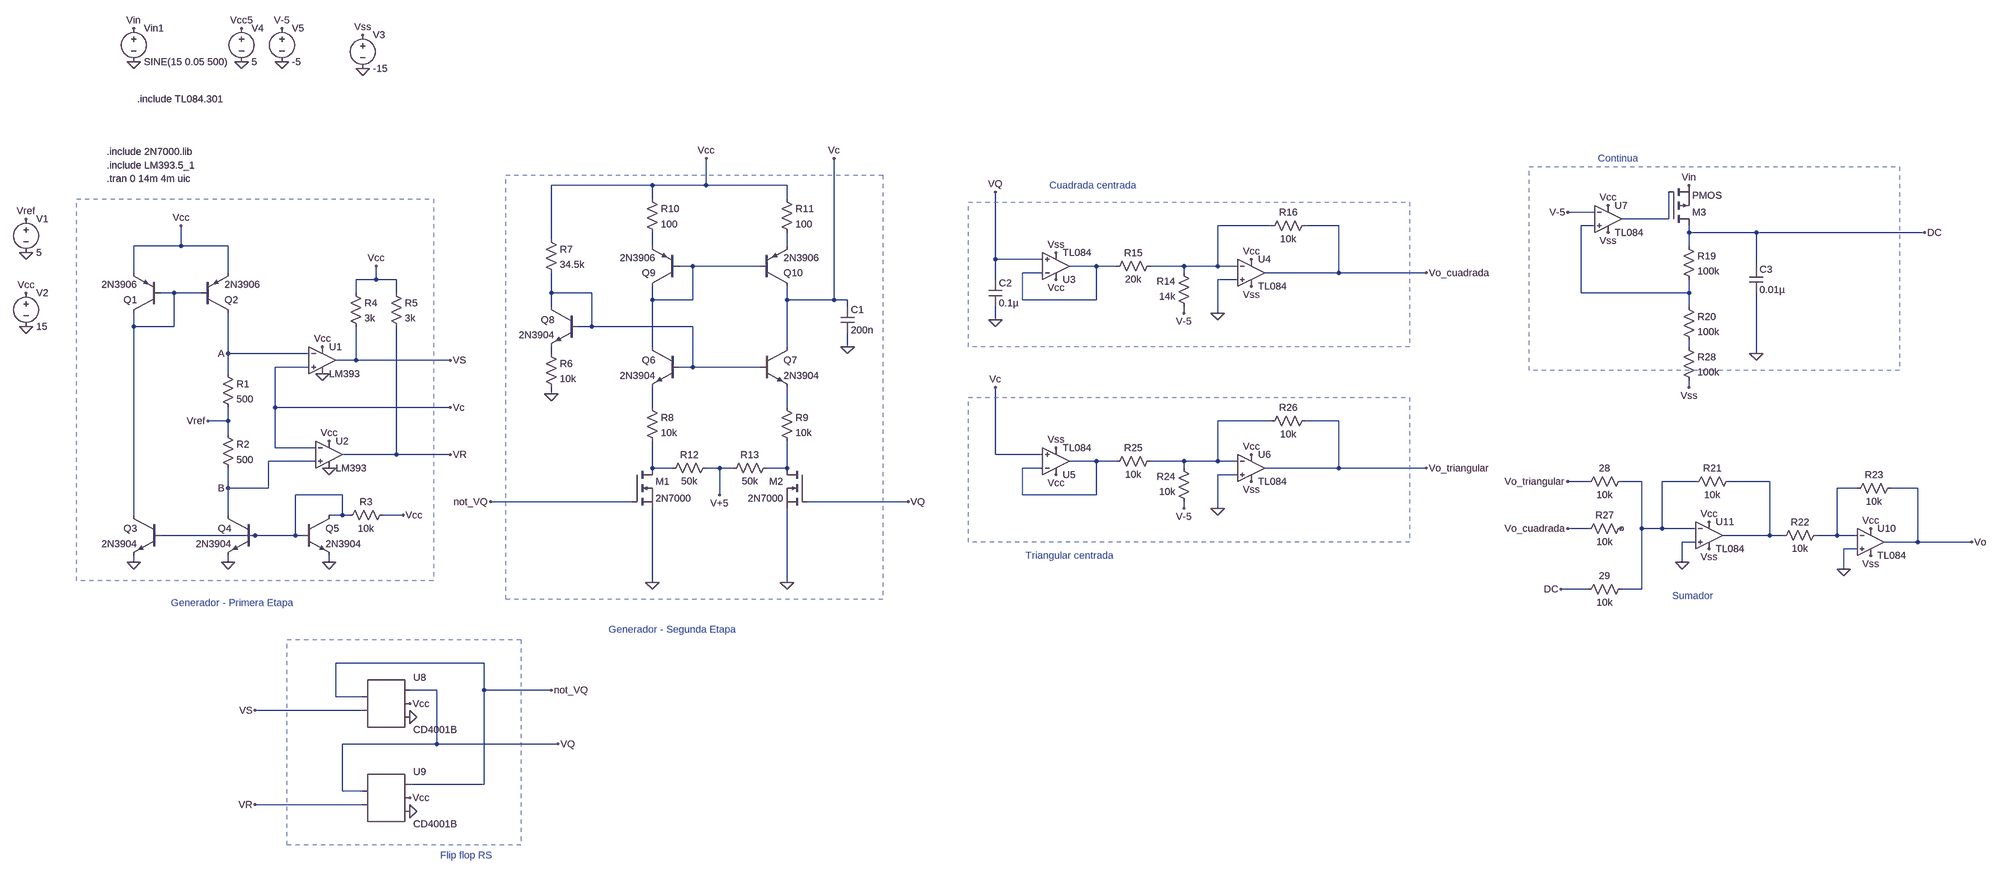
[diagram p0: schematic CIRCUITO_FINAL_PROLIJO_DC(correcta).asc]
CIRCUITO_FINAL_PROLIJO_DC(correcta).asc, the LTspice schematic file:
Version 4
SHEET 1 4360 2064
WIRE 720 -176 480 -176
WIRE 848 -176 848 -240
WIRE 848 -176 720 -176
WIRE 1040 -176 848 -176
WIRE 720 -144 720 -176
WIRE 1040 -144 1040 -176
WIRE 2976 -112 2912 -112
WIRE 3152 -96 3152 -160
WIRE 3152 -96 3040 -96
WIRE 2208 -80 2080 -80
WIRE 2368 -80 2288 -80
WIRE 2976 -80 2944 -80
WIRE 3200 -64 3200 -80
WIRE 3360 -64 3200 -64
WIRE 3760 -64 3360 -64
WIRE 480 -48 480 -176
WIRE -400 -32 -400 -80
WIRE -400 -32 -512 -32
WIRE -288 -32 -400 -32
WIRE 720 -32 720 -64
WIRE 1040 -32 1040 -64
WIRE 3200 -32 3200 -64
WIRE 1552 0 1552 -160
WIRE 1664 0 1552 0
WIRE 816 16 784 16
WIRE 976 16 816 16
WIRE 1792 16 1728 16
WIRE 1840 16 1792 16
WIRE 2000 16 1920 16
WIRE 2080 16 2080 -80
WIRE 2080 16 2000 16
WIRE 2128 16 2080 16
WIRE 3360 16 3360 -64
WIRE -512 32 -512 -32
WIRE -288 32 -288 -32
WIRE 1664 32 1616 32
WIRE 2000 32 2000 16
WIRE 2368 32 2368 -80
WIRE 2368 32 2192 32
WIRE 2576 32 2368 32
WIRE 64 48 64 16
WIRE 64 48 16 48
WIRE 112 48 64 48
WIRE 1552 48 1552 0
WIRE 2128 48 2080 48
WIRE -416 80 -448 80
WIRE -352 80 -416 80
WIRE 16 80 16 48
WIRE 112 80 112 48
WIRE 480 80 480 32
WIRE 576 80 480 80
WIRE 2944 80 2944 -80
WIRE 3200 80 3200 48
WIRE 3200 80 2944 80
WIRE 720 96 720 64
WIRE 816 96 816 16
WIRE 816 96 720 96
WIRE 1040 96 1040 64
WIRE 1152 96 1152 -240
WIRE 1152 96 1040 96
WIRE 1184 96 1152 96
WIRE 1616 96 1616 32
WIRE 1792 96 1792 16
WIRE 1792 96 1616 96
WIRE 480 112 480 80
WIRE 1184 112 1184 96
WIRE 3200 112 3200 80
WIRE 2000 128 2000 112
WIRE 2080 128 2080 48
WIRE 1552 144 1552 112
WIRE -512 160 -512 128
WIRE -416 160 -416 80
WIRE -416 160 -512 160
WIRE 576 160 576 80
WIRE 576 160 544 160
WIRE 816 160 576 160
WIRE 720 208 720 96
WIRE 1040 208 1040 96
WIRE 1184 208 1184 176
WIRE 3200 208 3200 192
WIRE -288 224 -288 128
WIRE -96 224 -288 224
WIRE 480 224 480 208
WIRE 3360 224 3360 80
WIRE 16 240 16 160
WIRE 16 240 -32 240
WIRE 240 240 16 240
WIRE -96 256 -176 256
WIRE 816 256 816 160
WIRE 816 256 784 256
WIRE 976 256 816 256
WIRE -288 272 -288 224
WIRE 3200 304 3200 288
WIRE 480 320 480 304
WIRE -176 352 -176 256
WIRE 240 352 -176 352
WIRE 720 352 720 304
WIRE 1040 352 1040 304
WIRE -288 384 -288 352
WIRE -288 384 -336 384
WIRE 2208 384 2080 384
WIRE 2368 384 2288 384
WIRE -288 416 -288 384
WIRE -176 448 -176 352
WIRE -80 448 -176 448
WIRE 112 464 112 160
WIRE 112 464 -16 464
WIRE 240 464 112 464
WIRE 1552 464 1552 304
WIRE 1664 464 1552 464
WIRE -80 480 -192 480
WIRE 1792 480 1728 480
WIRE 1840 480 1792 480
WIRE 2000 480 1920 480
WIRE 2080 480 2080 384
WIRE 2080 480 2000 480
WIRE 2128 480 2080 480
WIRE 720 496 720 432
WIRE 768 496 720 496
WIRE 880 496 848 496
WIRE 912 496 880 496
WIRE 1040 496 1040 432
WIRE 1040 496 992 496
WIRE 1664 496 1616 496
WIRE 2000 496 2000 480
WIRE 2368 496 2368 384
WIRE 2368 496 2192 496
WIRE 2576 496 2368 496
WIRE 2128 512 2080 512
WIRE 2960 528 2912 528
WIRE 3088 528 3040 528
WIRE 3216 528 3136 528
WIRE 3392 528 3296 528
WIRE -288 544 -288 496
WIRE -192 544 -192 480
WIRE -192 544 -288 544
WIRE 3600 544 3552 544
WIRE 3744 544 3680 544
WIRE -16 560 -128 560
WIRE 880 560 880 496
WIRE 1616 560 1616 496
WIRE 1792 560 1792 480
WIRE 1792 560 1616 560
WIRE 672 576 336 576
WIRE 1328 576 1088 576
WIRE 2000 592 2000 576
WIRE 2080 592 2080 512
WIRE -512 608 -512 160
WIRE -288 608 -288 544
WIRE -16 608 -16 560
WIRE -16 608 -48 608
WIRE 0 608 -16 608
WIRE 128 608 80 608
WIRE 2960 640 2912 640
WIRE 3088 640 3088 528
WIRE 3136 640 3136 528
WIRE 3136 640 3088 640
WIRE 3216 640 3136 640
WIRE -224 656 -448 656
WIRE -128 656 -128 560
WIRE -128 656 -224 656
WIRE -112 656 -128 656
WIRE 3392 656 3392 528
WIRE 3392 656 3280 656
WIRE 3424 656 3392 656
WIRE 3552 656 3552 544
WIRE 3552 656 3504 656
WIRE 3600 656 3552 656
WIRE 3216 672 3184 672
WIRE 3744 672 3744 544
WIRE 3744 672 3664 672
WIRE 3872 672 3744 672
WIRE 3600 688 3568 688
WIRE -512 720 -512 704
WIRE -288 720 -288 704
WIRE -48 720 -48 704
WIRE 3184 720 3184 672
WIRE 3568 736 3568 688
WIRE 720 768 720 592
WIRE 1040 768 1040 592
WIRE 2960 784 2896 784
WIRE 3088 784 3088 640
WIRE 3088 784 3040 784
WIRE 320 960 -32 960
WIRE 208 1024 144 1024
WIRE 320 1024 320 960
WIRE 480 1024 320 1024
WIRE -32 1040 -32 960
WIRE 32 1040 -32 1040
WIRE 32 1072 -224 1072
WIRE 208 1152 208 1024
WIRE 208 1152 -16 1152
WIRE 496 1152 208 1152
WIRE 320 1248 320 1024
WIRE 320 1248 144 1248
WIRE -16 1264 -16 1152
WIRE 32 1264 -16 1264
WIRE 32 1296 -224 1296
FLAG -48 720 0
FLAG -288 720 0
FLAG -512 720 0
FLAG 480 320 0
FLAG 1184 208 0
FLAG 848 -240 Vcc
FLAG 880 560 V+5
FLAG 1040 768 0
FLAG 720 768 0
FLAG -400 -80 Vcc
FLAG 128 608 Vcc
FLAG 240 240 VS
FLAG 240 464 VR
FLAG -336 384 Vref
FLAG 240 352 Vc
FLAG 1328 576 VQ
FLAG 336 576 not_VQ
FLAG 1152 -240 Vc
FLAG -768 -16 0
FLAG -768 80 Vcc
FLAG 32 -800 Vss
FLAG 32 -720 0
FLAG -768 160 0
FLAG -256 -816 Vcc5
FLAG -256 -736 0
FLAG -160 -736 0
FLAG -160 -816 V-5
FLAG -512 -816 Vin
FLAG -512 -736 0
FLAG -768 -96 Vref
FLAG -64 208 Vcc
FLAG -64 272 0
FLAG -48 432 Vcc
FLAG -48 496 0
FLAG 64 16 Vcc
FLAG -288 224 A
FLAG -288 544 B
FLAG 1696 48 Vcc
FLAG 1696 -16 Vss
FLAG 1552 144 0
FLAG 2000 128 V-5
FLAG 2080 128 0
FLAG 1552 -160 VQ
FLAG 2576 32 Vo_cuadrada
FLAG 2912 -112 V-5
FLAG 3360 224 0
FLAG 3760 -64 DC
FLAG 3872 672 Vo
FLAG 3184 720 0
FLAG 3568 736 0
FLAG 2160 0 Vcc
FLAG 2160 64 Vss
FLAG 1696 512 Vcc
FLAG 1696 448 Vss
FLAG 2000 592 V-5
FLAG 2080 592 0
FLAG 1552 304 Vc
FLAG 2576 496 Vo_triangular
FLAG 2160 464 Vcc
FLAG 2160 528 Vss
FLAG 3008 -128 Vcc
FLAG 3008 -64 Vss
FLAG 3632 640 Vcc
FLAG 3632 704 Vss
FLAG 3248 624 Vcc
FLAG 3248 688 Vss
FLAG -224 1072 VS
FLAG -224 1296 VR
FLAG 144 1280 Vcc
FLAG 144 1312 0
FLAG 144 1088 0
FLAG 144 1056 Vcc
FLAG 496 1152 VQ
FLAG 480 1024 not_VQ
FLAG 2896 784 DC
FLAG 3200 304 Vss
FLAG 2912 528 Vo_triangular
FLAG 3200 -176 Vin
FLAG 2912 640 Vo_cuadrada
SYMBOL pnp -352 128 M180
SYMATTR InstName Q2
SYMATTR Value 2N3906
SYMBOL pnp -448 128 R180
SYMATTR InstName Q1
SYMATTR Value 2N3906
SYMBOL npn -448 608 M0
SYMATTR InstName Q3
SYMATTR Value 2N3904
SYMBOL res -304 256 R0
SYMATTR InstName R1
SYMATTR Value 500
SYMBOL res -304 400 R0
SYMATTR InstName R2
SYMATTR Value 500
SYMBOL npn -224 608 M0
SYMATTR InstName Q4
SYMATTR Value 2N3904
SYMBOL npn -112 608 R0
SYMATTR InstName Q5
SYMATTR Value 2N3904
SYMBOL res 96 592 R90
WINDOW 0 0 56 VBottom 2
WINDOW 3 32 56 VTop 2
SYMATTR InstName R3
SYMATTR Value 10k
SYMBOL res 864 480 R90
WINDOW 0 0 56 VBottom 2
WINDOW 3 32 56 VTop 2
SYMATTR InstName R12
SYMATTR Value 50k
SYMBOL res 1008 480 R90
WINDOW 0 0 56 VBottom 2
WINDOW 3 32 56 VTop 2
SYMATTR InstName R13
SYMATTR Value 50k
SYMBOL npn 976 208 R0
SYMATTR InstName Q7
SYMATTR Value 2N3904
SYMBOL npn 784 208 M0
SYMATTR InstName Q6
SYMATTR Value 2N3904
SYMBOL npn 544 112 M0
SYMATTR InstName Q8
SYMATTR Value 2N3904
SYMBOL res 464 208 R0
SYMATTR InstName R6
SYMATTR Value 10k
SYMBOL res 464 -64 R0
SYMATTR InstName R7
SYMATTR Value 34.5k
SYMBOL cap 1168 112 R0
SYMATTR InstName C1
SYMATTR Value 200n
SYMBOL pnp 784 64 R180
SYMATTR InstName Q9
SYMATTR Value 2N3906
SYMBOL pnp 976 64 M180
SYMATTR InstName Q10
SYMATTR Value 2N3906
SYMBOL voltage -768 -112 R0
WINDOW 123 0 0 Left 2
WINDOW 39 0 0 Left 2
SYMATTR InstName V1
SYMATTR Value 5
SYMBOL voltage -768 64 R0
WINDOW 123 0 0 Left 2
WINDOW 39 0 0 Left 2
SYMATTR InstName V2
SYMATTR Value 15
SYMBOL voltage 32 -816 R0
WINDOW 123 0 0 Left 2
WINDOW 39 0 0 Left 2
SYMATTR InstName V3
SYMATTR Value -15
SYMBOL voltage -256 -832 R0
WINDOW 123 0 0 Left 2
WINDOW 39 0 0 Left 2
SYMATTR InstName V4
SYMATTR Value 5
SYMBOL voltage -160 -832 R0
WINDOW 123 0 0 Left 2
WINDOW 39 0 0 Left 2
SYMATTR InstName V5
SYMATTR Value -5
SYMBOL voltage -512 -832 R0
WINDOW 123 0 0 Left 2
WINDOW 39 0 0 Left 2
SYMATTR InstName Vin1
SYMATTR Value SINE(15 0.05 500)
SYMBOL opamp2 -48 400 R0
SYMATTR InstName U2
SYMATTR Value LM393
SYMBOL opamp2 -64 176 R0
SYMATTR InstName U1
SYMATTR Value LM393
SYMBOL res 704 336 R0
SYMATTR InstName R8
SYMATTR Value 10k
SYMBOL res 1024 336 R0
SYMATTR InstName R9
SYMATTR Value 10k
SYMBOL res 1024 -160 R0
SYMATTR InstName R11
SYMATTR Value 100
SYMBOL res 704 -160 R0
SYMATTR InstName R10
SYMATTR Value 100
SYMBOL res 0 64 R0
SYMATTR InstName R4
SYMATTR Value 3k
SYMBOL res 96 64 R0
SYMATTR InstName R5
SYMATTR Value 3k
SYMBOL cap 1536 48 R0
SYMATTR InstName C2
SYMATTR Value 0.1µ
SYMBOL res 2016 128 R180
WINDOW 0 36 76 Left 2
WINDOW 3 36 40 Left 2
SYMATTR InstName R14
SYMATTR Value 14k
SYMBOL res 1936 0 R90
WINDOW 0 0 56 VBottom 2
WINDOW 3 32 56 VTop 2
SYMATTR InstName R15
SYMATTR Value 20k
SYMBOL res 2304 -96 R90
WINDOW 0 0 56 VBottom 2
WINDOW 3 32 56 VTop 2
SYMATTR InstName R16
SYMATTR Value 10k
SYMBOL cap 3344 16 R0
SYMATTR InstName C3
SYMATTR Value 0.01µ
SYMBOL res 3184 -48 R0
SYMATTR InstName R19
SYMATTR Value 100k
SYMBOL res 3184 96 R0
SYMATTR InstName R20
SYMATTR Value 100k
SYMBOL pmos 3152 -80 M180
SYMATTR InstName M3
SYMBOL res 3312 512 R90
WINDOW 0 0 56 VBottom 2
WINDOW 3 32 56 VTop 2
SYMATTR InstName R21
SYMATTR Value 10k
SYMBOL res 3520 640 R90
WINDOW 0 0 56 VBottom 2
WINDOW 3 32 56 VTop 2
SYMATTR InstName R22
SYMATTR Value 10k
SYMBOL res 3696 528 R90
WINDOW 0 0 56 VBottom 2
WINDOW 3 32 56 VTop 2
SYMATTR InstName R23
SYMATTR Value 10k
SYMBOL opamp2 1696 80 M180
SYMATTR InstName U3
SYMATTR Value TL084
SYMBOL opamp2 2160 -32 R0
SYMATTR InstName U4
SYMATTR Value TL084
SYMBOL res 2016 592 R180
WINDOW 0 36 76 Left 2
WINDOW 3 36 40 Left 2
SYMATTR InstName R24
SYMATTR Value 10k
SYMBOL res 1936 464 R90
WINDOW 0 0 56 VBottom 2
WINDOW 3 32 56 VTop 2
SYMATTR InstName R25
SYMATTR Value 10k
SYMBOL res 2304 368 R90
WINDOW 0 0 56 VBottom 2
WINDOW 3 32 56 VTop 2
SYMATTR InstName R26
SYMATTR Value 10k
SYMBOL opamp2 1696 544 M180
SYMATTR InstName U5
SYMATTR Value TL084
SYMBOL opamp2 2160 432 R0
SYMATTR InstName U6
SYMATTR Value TL084
SYMBOL opamp2 3008 -160 R0
SYMATTR InstName U7
SYMATTR Value TL084
SYMBOL opamp2 3632 608 R0
SYMATTR InstName U10
SYMATTR Value TL084
SYMBOL opamp2 3248 592 R0
SYMATTR InstName U11
SYMATTR Value TL084
SYMBOL AutoGenerated/CD4001B 80 1056 R0
SYMATTR InstName U8
SYMBOL AutoGenerated/CD4001B 80 1280 R0
SYMATTR InstName U9
SYMBOL nmos 672 496 R0
SYMATTR InstName M1
SYMATTR Value 2N7000
SYMATTR Prefix X
SYMBOL nmos 1088 496 M0
SYMATTR InstName M2
SYMATTR Value 2N7000
SYMATTR Prefix X
SYMBOL res 3184 192 R0
SYMATTR InstName R28
SYMATTR Value 100k
SYMBOL res 3056 512 R90
WINDOW 0 0 56 VBottom 2
WINDOW 3 32 56 VTop 2
SYMATTR InstName 28
SYMATTR Value 10k
SYMBOL res 3056 624 R90
WINDOW 0 0 56 VBottom 2
WINDOW 3 32 56 VTop 2
SYMATTR InstName R27
SYMATTR Value 10k
SYMBOL res 3056 768 R90
WINDOW 0 0 56 VBottom 2
WINDOW 3 32 56 VTop 2
SYMATTR InstName 29
SYMATTR Value 10k
TEXT -424 816 Left 2 ;Generador - Primera Etapa
TEXT 616 880 Left 2 ;Generador - Segunda Etapa
TEXT -576 -192 Left 2 !.tran 0 14m 4m uic
TEXT -504 -648 Left 2 !.include TL084.301
TEXT -576 -224 Left 2 !.include LM393.5_1
TEXT 1624 704 Left 2 ;Triangular centrada
TEXT 1680 -176 Left 2 ;Cuadrada centrada
TEXT 2984 -240 Left 2 ;Continua
TEXT 3160 800 Left 2 ;Sumador
TEXT 216 1416 Left 2 ;Flip flop RS
TEXT -576 -256 Left 2 !.include 2N7000.lib
RECTANGLE Normal 372 -200 1268 808 2
RECTANGLE Normal -648 -144 200 764 2
RECTANGLE Normal 1488 -136 2536 208 2
RECTANGLE Normal 2820 -220 3700 264 2
RECTANGLE Normal 1488 328 2536 672 2
RECTANGLE Normal -148 904 408 1392 2

The netlist it stands for:
* CIRCUITO_FINAL_PROLIJO_DC(correcta).asc
Q2 A N008 Vcc 0 2N3906
Q1 N008 N008 Vcc 0 2N3906
Q3 N008 N021 0 0 2N3904
R1 A Vref 500
R2 Vref B 500
Q4 B N021 0 0 2N3904
Q5 N021 N021 0 0 2N3904
R3 Vcc N021 10k
R12 V+5 N016 50k
R13 N017 V+5 50k
Q7 Vc N009 N013 0 2N3904
Q6 N006 N009 N012 0 2N3904
Q8 N009 N009 N011 0 2N3904
R6 N011 0 10k
R7 Vcc N009 34.5k
C1 Vc 0 200n
Q9 N006 N006 N004 0 2N3906
Q10 Vc N006 N005 0 2N3906
V1 Vref 0 5
V2 Vcc 0 15
V3 Vss 0 -15
V4 Vcc5 0 5
V5 V-5 0 -5
Vin1 Vin 0 SINE(15 0.05 500)
XU2 B Vc Vcc 0 VR LM393  ; pins In+ In- V+ V- OUT
XU1 Vc A Vcc 0 VS LM393  ; pins In+ In- V+ V- OUT
R8 N012 N016 10k
R9 N013 N017 10k
R11 Vcc N005 100
R10 Vcc N004 100
R4 Vcc VS 3k
R5 Vcc VR 3k
C2 VQ 0 0.1µ
R14 V-5 N002 14k
R15 N002 N007 20k
R16 Vo_cuadrada N002 10k
C3 DC 0 0.01µ
R19 DC N003 100k
R20 N003 N010 100k
M3 DC N001 Vin Vin PMOS
R21 N019 N018 10k
R22 N020 N019 10k
R23 Vo N020 10k
XU3 VQ N007 Vcc Vss N007 TL084  ; pins In+ In- V+ V- OUT
XU4 0 N002 Vcc Vss Vo_cuadrada TL084  ; pins In+ In- V+ V- OUT
R24 V-5 N014 10k
R25 N014 N015 10k
R26 Vo_triangular N014 10k
XU5 Vc N015 Vcc Vss N015 TL084  ; pins In+ In- V+ V- OUT
XU6 0 N014 Vcc Vss Vo_triangular TL084  ; pins In+ In- V+ V- OUT
XU7 N003 V-5 Vcc Vss N001 TL084  ; pins In+ In- V+ V- OUT
XU10 0 N020 Vcc Vss Vo TL084  ; pins In+ In- V+ V- OUT
XU11 0 N018 Vcc Vss N019 TL084  ; pins In+ In- V+ V- OUT
* U8: CD4001B (symbol AutoGenerated/CD4001B not available, pins judged from their places): pin1=not_VQ pin2=VS pin3=VQ pin4=Vcc pin5=0
* U9: CD4001B (symbol AutoGenerated/CD4001B not available, pins judged from their places): pin1=VQ pin2=VR pin3=not_VQ pin4=Vcc pin5=0
XM1 N016 not_VQ 0 2N7000  ; pins D G S
XM2 N017 VQ 0 2N7000  ; pins D G S
R28 N010 Vss 100k
R§28 N018 Vo_triangular 10k
R27 NC_01 Vo_cuadrada 10k
R§29 N018 DC 10k
.model NPN NPN
.model PNP PNP
.lib standard.bjt
.model NMOS NMOS
.model PMOS PMOS
.lib standard.mos
* Generador - Primera Etapa
* Generador - Segunda Etapa
.tran 0 14m 4m uic
.include TL084.301
.include LM393.5_1
* Triangular centrada
* Cuadrada centrada
* Continua
* Sumador
* Flip flop RS
.include 2N7000.lib
.backanno
.end